# EAGLE design ToneControl-BC547 (EAGLE 7.2.0)
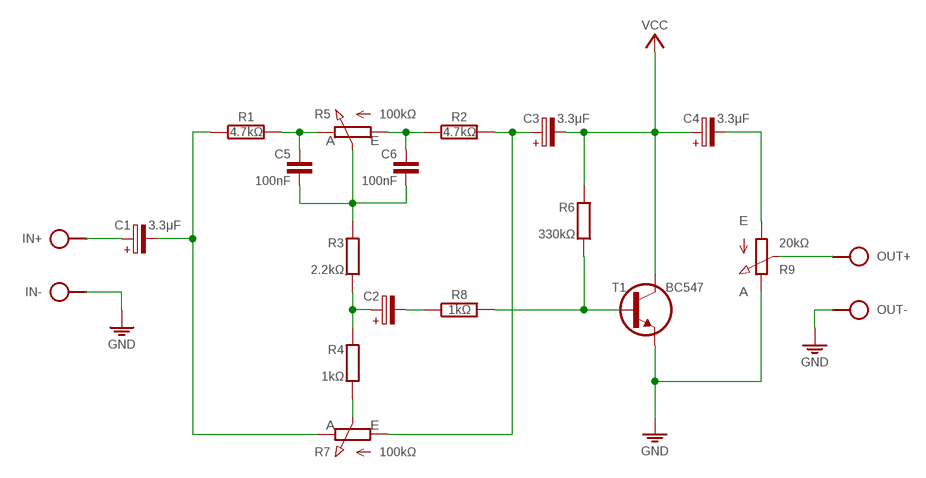
[diagram p0: schematic, sheet 1]

## Parts
C1  3.3μF  CPOL-HE2,5-3  [E2,5-3]
C2  CPOL-HE2,5-3  [E2,5-3]
C3  3.3μF  CPOL-HE2,5-3  [E2,5-3]
C4  3.3μF  CPOL-HE2,5-3  [E2,5-3]
C5  100nF  C050-020X044/V  [C050-020X044/V]
C6  100nF  C050-020X044/V  [C050-020X044/V]
IN  SPAD+--+  [SPAD-+]
OUT  SPAD+-+-  [SPAD+-]
R1  4.7kΩ  R-H0204/10  [0204/10]
R2  4.7kΩ  R-H0204/10  [0204/10]
R3  2.2kΩ  R0204/10-V  [0204/10-V]
R4  1kΩ  R0204/10-V  [0204/10-V]
R5  100kΩ  POT-H  [POT]
R6  330kΩ  R0204/10-V  [0204/10-V]
R7  100kΩ  POT-H  [POT]
R8  1kΩ  R-H0204/10  [0204/10]
R9  20kΩ  POT  [POT]
S1  VCC_GNDR  [SPAD+-]
T1  BC547  BC547CBE  [TO92-CBE]

## Nets
GND: IN.1 OUT.1 R9.E S1.1 T1.E
N$1: C5.1 R1.2 R5.E
N$2: C6.1 R2.1 R5.A
N$3: C5.2 C6.2 R3.1 R5.S
N$4: C2.+ R3.2 R4.1
N$5: R4.2 R7.S
N$6: C2.- R8.1
N$7: C3.+ R2.2 R7.A
N$8: R6.2 R8.2 T1.B
N$10: C4.- R9.A
N$11: C1.- R1.1 R7.E
N$12: C1.+ IN.2
N$15: OUT.2 R9.S
VCC: C3.- C4.+ R6.1 S1.2 T1.C

## Library data of the parts
C1-C4 = c:CPOL-H
C5 C6 = c:C: CAPACITOR, European symbol
IN OUT = pad:SPAD+-
R1 R2 R8 = r:R-H
R3 R4 R6 = r:R: RESISTOR, European symbol
R5 R7 = r:POT-H
R9 = r:POT
S1 = pad:VCC_GND
T1 = t:BC547

## Board
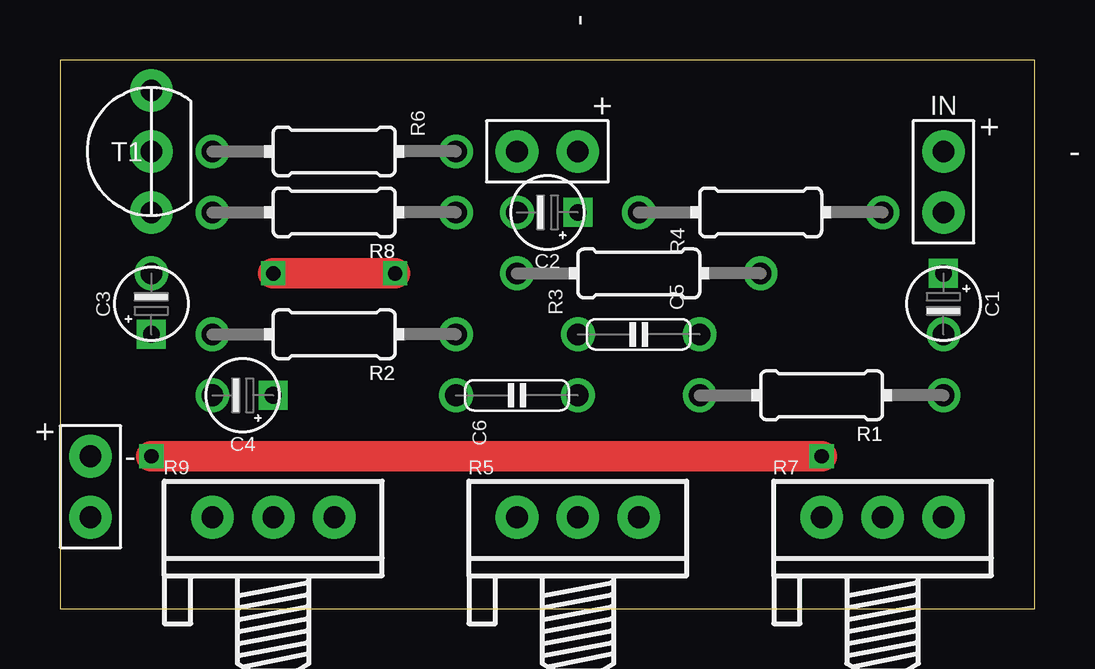
[diagram p1: board, top side]
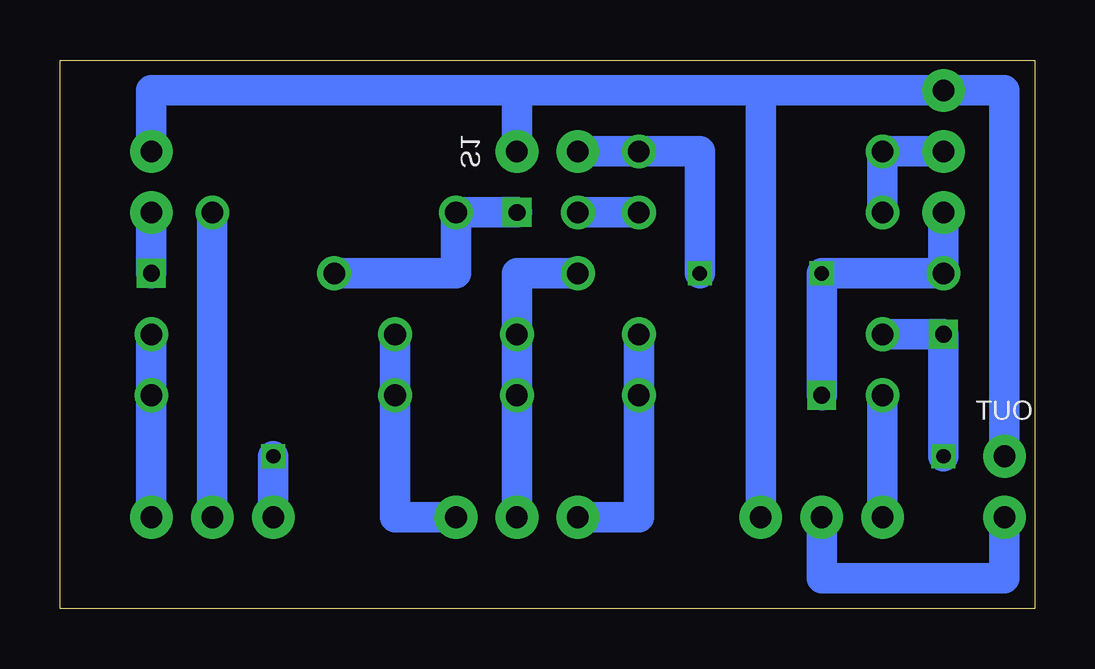
[diagram p2: board, bottom side, seen from below]

Size 40.64 x 22.86 mm. Coordinates in mm from the lower left corner, seen from the top.
Outline: 40.64,0 40.64,22.86 0,22.86 0,0 40.64,0
Copper layers (1*16): Top 0.035mm / dielectric 1.5mm / Bottom 0.035mm
Design rules "default": minimum track width 10mil, minimum drill 24mil, track to track 8mil, track to pad 8mil, pad to pad 8mil, via to via 8mil, smd to smd 8mil, copper to edge 40mil, drill to drill 8mil, minimum pad ring 10mil, minimum via ring 8mil, stop-mask expansion 4mil, vias tented up to drill 0mil, thermal gap 10mil

### Footprints (pad centres in the part's own frame; a part is rotated, then mirrored left to right if it is on the bottom)
E2,5-3 = drill 0.7 square: + -1.27,0 | drill 0.9: - 1.27,0
C050-020X044/V = drill 0.9: 1 0,2.54; 2 0,-2.54
SPAD-+ = drill 0.9 pad 1.778: 1 0,-1.27; 2 0,1.27
SPAD+- = drill 0.9 pad 1.778: 1 0,-1.27; 2 0,1.27
0204/10 = drill 0.9: 1 -5.08,0; 2 5.08,0
0204/10-V = drill 0.9: 1 0,5.08; 2 0,-5.08
POT = drill 0.9 pad 1.778: A -2.54,0; E 2.54,0; S 0,0
TO92-CBE = drill 0.9 pad 1.778: B 0,0; C 0,2.54; E 0,-2.54

### Placement (x,y rotation side)
C1  36.83,12.7 270 top
C2  20.32,16.51 180 top
C3  3.81,12.7 90 top
C4  7.62,8.89 180 top
C5  24.13,11.43 270 top
C6  19.05,8.89 90 top
IN  36.83,17.78 180 top
OUT  1.27,5.08 180 top
R1  31.75,8.89 180 top
R2  11.43,11.43 180 top
R3  24.13,13.97 90 top
R4  29.21,16.51 90 top
R5  21.59,3.81 0 top
R6  11.43,19.05 270 top
R7  34.29,3.81 0 top
R8  11.43,16.51 180 top
R9  8.89,3.81 0 top
S1  20.32,19.05 90 top
T1  3.81,19.05 180 top

### Tracks (layer width: path | path; a pad name or v marks a point on that pad's centre or on a via)
GND
  Bottom 1.27: 11.43,21.59 R9.E | 21.59,21.59 11.43,21.59 | 11.43,21.59 T1.E 1.27,21.59 OUT.1 | IN.1 36.83,21.59 21.59,21.59 | 21.59,21.59 S1.1
N$1
  Bottom 1.27: C5.1 R1.2 26.67,3.81 R5.E
N$2
  Bottom 1.27: R5.A 16.51,3.81 C6.1 R2.1
N$3
  Bottom 1.27: C6.2 21.59,13.97 R3.1 | C6.2 R5.S | C6.2 C5.2
N$4  (via drill 0.6)
  Bottom 1.27: R3.2 24.13,13.97 R4.1 C2.+
  other vias: 24.13,16.51
N$5
  Bottom 1.27: R4.2 R7.S
N$6
  Bottom 1.27: R8.1 C2.-
N$7  (via drill 0.6)
  Top 1.27: v3.81,6.35 v31.75,6.35
  Bottom 1.27: v3.81,6.35 C3.+ R2.2 | v31.75,6.35 R7.A
N$8
  Bottom 1.27: T1.B R6.2 R8.2
N$10
  Bottom 1.27: C4.- 6.35,7.62 R9.A
N$11
  Bottom 1.27: R7.E R1.1 C1.-
N$12
  Bottom 1.27: IN.2 C1.+
N$15
  Bottom 1.27: OUT.2 1.27,1.27 8.89,1.27 R9.S
VCC  (via drill 0.6)
  Top 1.27: v13.97,13.97 v8.89,13.97
  Bottom 1.27: T1.C C3.- | 6.35,13.97 C3.- | C4.+ v8.89,13.97 C3.- | v13.97,13.97 13.97,19.05 R6.1 S1.2